# EAGLE schematic BMS Segment (EAGLE 7.7.0)
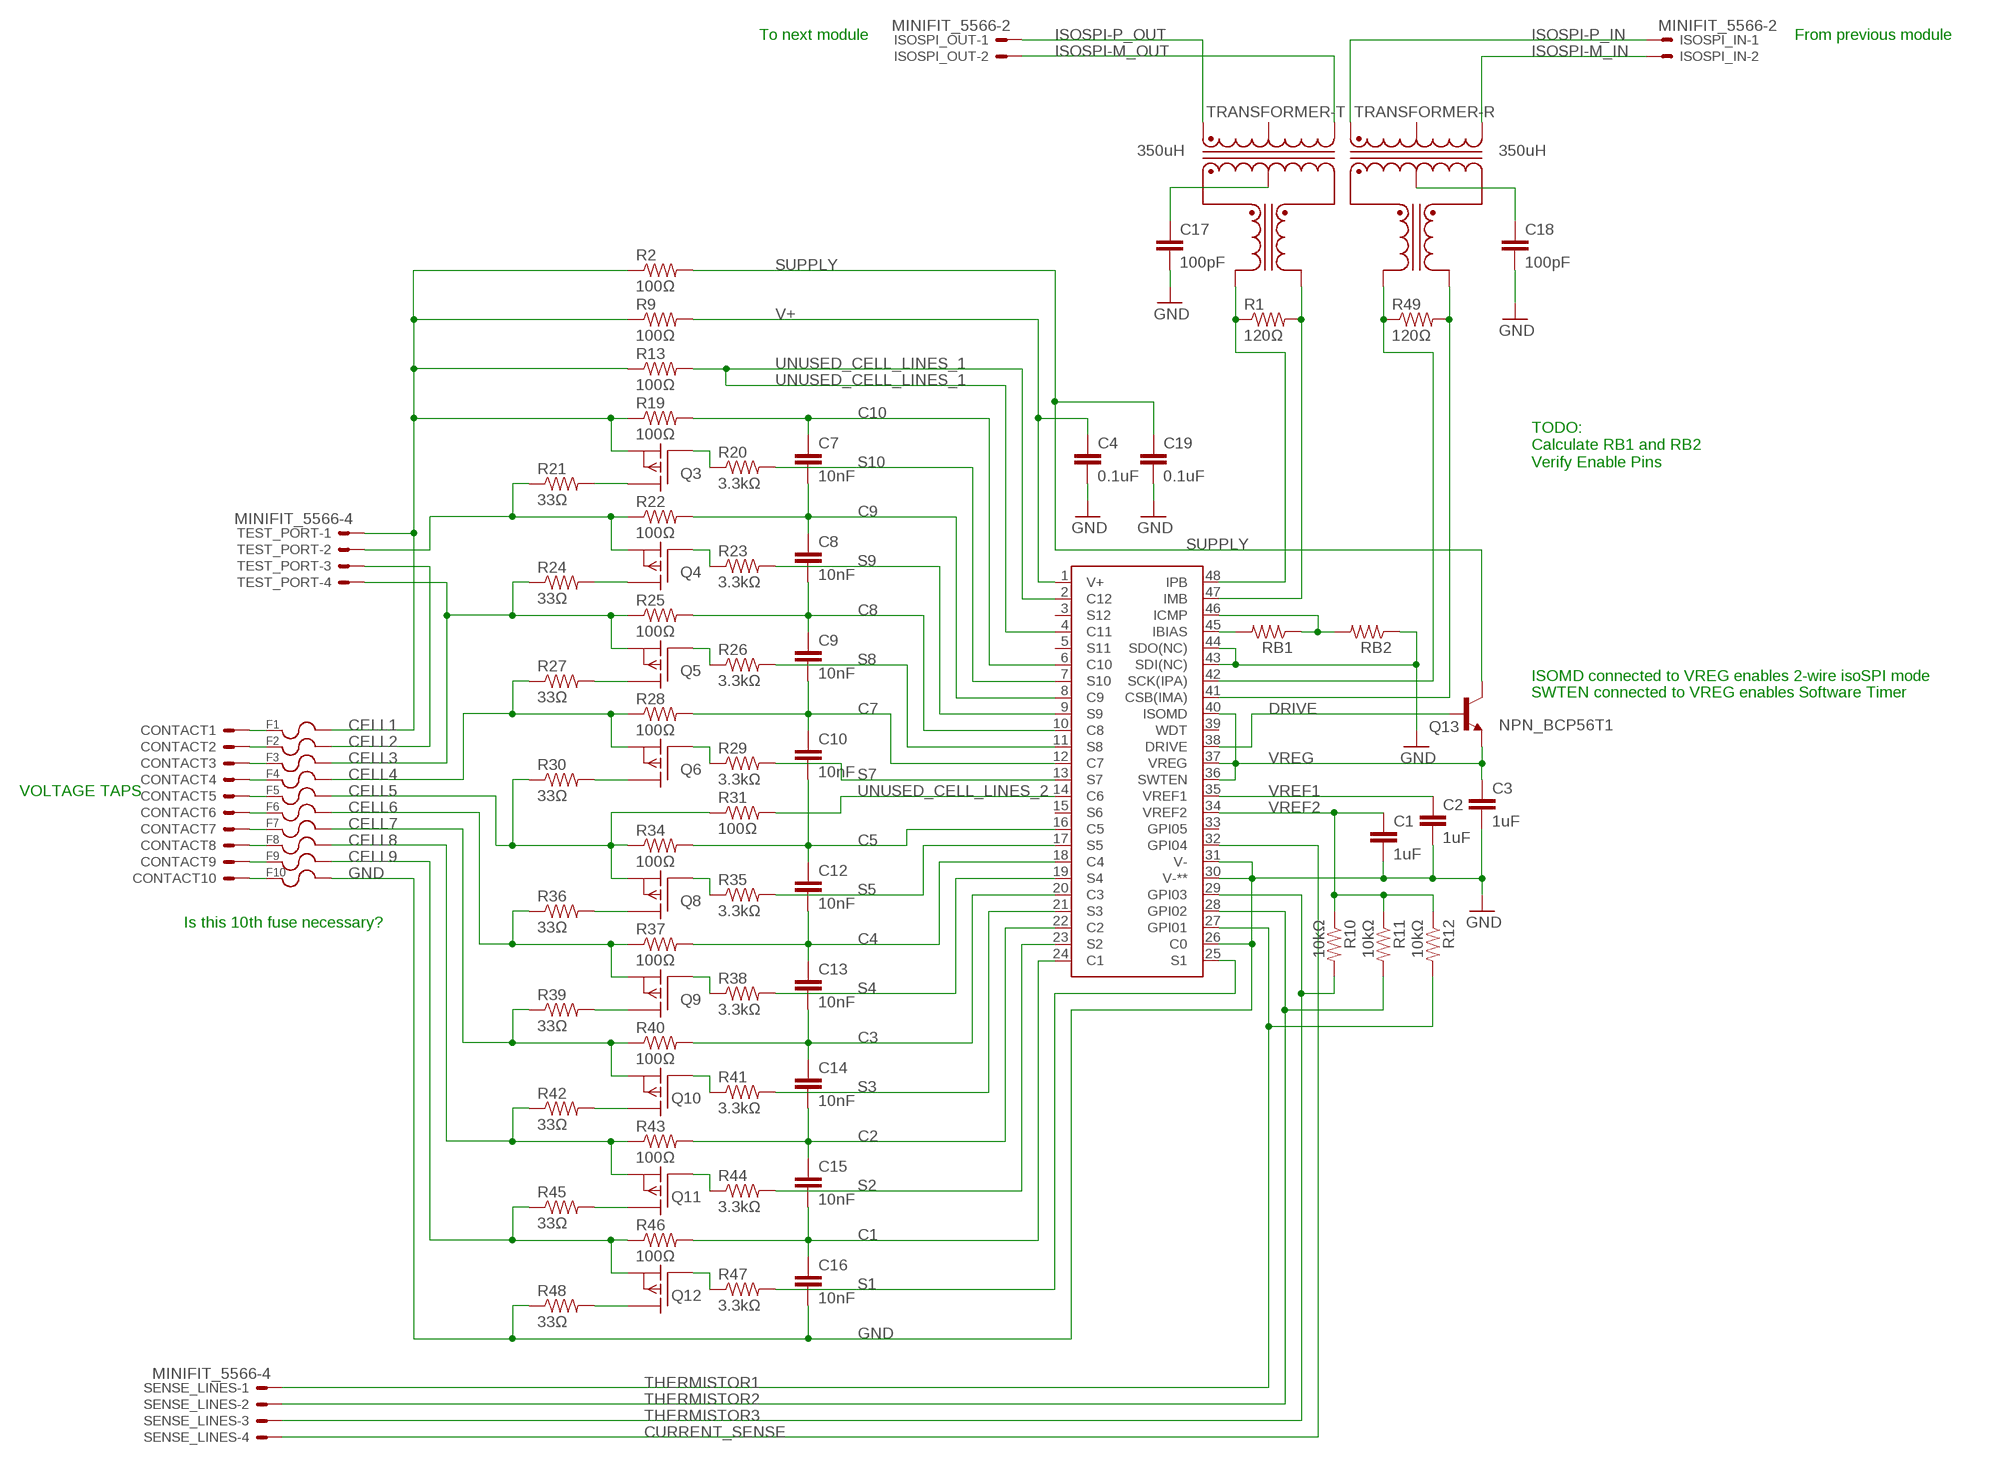
[diagram p0: schematic, sheet 1]

## Parts
C1  1uF  CAP0805  [0805]
C2  1uF  CAP0805  [0805]
C3  1uF  CAP0805  [0805]
C4  0.1uF  CAP0805  [0805]
C7  10nF  CAP0805  [0805]
C8  10nF  CAP0805  [0805]
C9  10nF  CAP0805  [0805]
C10  10nF  CAP0805  [0805]
C12  10nF  CAP0805  [0805]
C13  10nF  CAP0805  [0805]
C14  10nF  CAP0805  [0805]
C15  10nF  CAP0805  [0805]
C16  10nF  CAP0805  [0805]
C17  100pF  CAP0805  [0805]
C18  100pF  CAP0805  [0805]
C19  0.1uF  CAP0805  [0805]
CONTACT1  SPRING_CONTACT  [S1791-42R]
CONTACT2  SPRING_CONTACT  [S1791-42R]
CONTACT3  SPRING_CONTACT  [S1791-42R]
CONTACT4  SPRING_CONTACT  [S1791-42R]
CONTACT5  SPRING_CONTACT  [S1791-42R]
CONTACT6  SPRING_CONTACT  [S1791-42R]
CONTACT7  SPRING_CONTACT  [S1791-42R]
CONTACT8  SPRING_CONTACT  [S1791-42R]
CONTACT9  SPRING_CONTACT  [S1791-42R]
CONTACT10  SPRING_CONTACT  [S1791-42R]
F1  0751.0110_FUSE_CLIP  [0751.0110]
F2  0751.0110_FUSE_CLIP  [0751.0110]
F3  0751.0110_FUSE_CLIP  [0751.0110]
F4  0751.0110_FUSE_CLIP  [0751.0110]
F5  0751.0110_FUSE_CLIP  [0751.0110]
F6  0751.0110_FUSE_CLIP  [0751.0110]
F7  0751.0110_FUSE_CLIP  [0751.0110]
F8  0751.0110_FUSE_CLIP  [0751.0110]
F9  0751.0110_FUSE_CLIP  [0751.0110]
F10  0751.0110_FUSE_CLIP  [0751.0110]
ISOSPI_IN  MINIFIT_5566-2  [MINIFIT_5566-2]
ISOSPI_OUT  MINIFIT_5566-2  [MINIFIT_5566-2]
Q3  P-CHANNEL_MOSFET_DMP3099L-7  [SOT23]
Q4  P-CHANNEL_MOSFET_DMP3099L-7  [SOT23]
Q5  P-CHANNEL_MOSFET_DMP3099L-7  [SOT23]
Q6  P-CHANNEL_MOSFET_DMP3099L-7  [SOT23]
Q8  P-CHANNEL_MOSFET_DMP3099L-7  [SOT23]
Q9  P-CHANNEL_MOSFET_DMP3099L-7  [SOT23]
Q10  P-CHANNEL_MOSFET_DMP3099L-7  [SOT23]
Q11  P-CHANNEL_MOSFET_DMP3099L-7  [SOT23]
Q12  P-CHANNEL_MOSFET_DMP3099L-7  [SOT23]
Q13  NPN_BCP56T1  [SOT223]
R1  120Ω  RESISTOR0805-RES  [0805]
R2  100Ω  RESISTOR0805-RES  [0805]
R9  100Ω  RESISTOR0805-RES  [0805]
R10  10kΩ  RESISTOR0805-RES  [0805]
R11  10kΩ  RESISTOR0805-RES  [0805]
R12  10kΩ  RESISTOR0805-RES  [0805]
R13  100Ω  RESISTOR0805-RES  [0805]
R19  100Ω  RESISTOR0805-RES  [0805]
R20  3.3kΩ  RESISTOR0805-RES  [0805]
R21  33Ω  RESISTOR2512  [R2512]
R22  100Ω  RESISTOR0805-RES  [0805]
R23  3.3kΩ  RESISTOR0805-RES  [0805]
R24  33Ω  RESISTOR2512  [R2512]
R25  100Ω  RESISTOR0805-RES  [0805]
R26  3.3kΩ  RESISTOR0805-RES  [0805]
R27  33Ω  RESISTOR2512  [R2512]
R28  100Ω  RESISTOR0805-RES  [0805]
R29  3.3kΩ  RESISTOR0805-RES  [0805]
R30  33Ω  RESISTOR2512  [R2512]
R31  100Ω  RESISTOR0805-RES  [0805]
R34  100Ω  RESISTOR0805-RES  [0805]
R35  3.3kΩ  RESISTOR0805-RES  [0805]
R36  33Ω  RESISTOR2512  [R2512]
R37  100Ω  RESISTOR0805-RES  [0805]
R38  3.3kΩ  RESISTOR0805-RES  [0805]
R39  33Ω  RESISTOR2512  [R2512]
R40  100Ω  RESISTOR0805-RES  [0805]
R41  3.3kΩ  RESISTOR0805-RES  [0805]
R42  33Ω  RESISTOR2512  [R2512]
R43  100Ω  RESISTOR0805-RES  [0805]
R44  3.3kΩ  RESISTOR0805-RES  [0805]
R45  33Ω  RESISTOR2512  [R2512]
R46  100Ω  RESISTOR0805-RES  [0805]
R47  3.3kΩ  RESISTOR0805-RES  [0805]
R48  33Ω  RESISTOR2512  [R2512]
R49  120Ω  RESISTOR0805-RES  [0805]
RB1  RESISTOR0805-RES  [0805]
RB2  RESISTOR0805-RES  [0805]
SENSE_LINES  MINIFIT_5566-4  [MINIFIT_5566-4]
TEST_PORT  MINIFIT_5566-4  [MINIFIT_5566-4]
TRANSFORMER-  350uH  TRANSFORMER_749010013  [749010013]
U$2  LTC6804-1  [LTC6804]

## Nets
C1: C15.2 C16.1 R46.2 U$2.24(C1)
C2: C14.2 C15.1 R43.2 U$2.22(C2)
C3: C13.2 C14.1 R40.2 U$2.20(C3)
C4: C12.2 C13.1 R37.2 U$2.18(C4)
C5: C10.2 C12.1 R34.2 U$2.16(C5)
C7: C9.2 C10.1 R28.2 U$2.12(C7)
C8: C8.2 C9.1 R25.2 U$2.10(C8)
C9: C7.2 C8.1 R22.2 U$2.8(C9)
C10: C7.1 R19.2 U$2.6(C10)
CELL1: F1.R1 F1.R2 Q3.2(S) R2.1 R9.1 R13.1 R19.1 TEST_PORT.1
CELL2: F2.R1 F2.R2 Q4.2(S) R21.1 R22.1 TEST_PORT.2 TEST_PORT.3
CELL3: F3.R1 F3.R2 Q5.2(S) R24.1 R25.1 TEST_PORT.4
CELL4: F4.R1 F4.R2 Q6.2(S) R27.1 R28.1
CELL5: F5.R1 F5.R2 Q8.2(S) R30.1 R31.1 R34.1
CELL6: F6.R1 F6.R2 Q9.2(S) R36.1 R37.1
CELL7: F7.R1 F7.R2 Q10.2(S) R39.1 R40.1
CELL8: F8.R1 F8.R2 Q11.2(S) R42.1 R43.1
CELL9: F9.R1 F9.R2 Q12.2(S) R45.1 R46.1
CURRENT_SENSE: SENSE_LINES.4 U$2.32(GPI04)
DRIVE: Q13.1(BASE) U$2.38(DRIVE)
GND: C1.2 C2.2 C3.2 C4.2 C16.2 C17.2 C18.2 C19.2 F10.R1 F10.R2 R48.1 RB2.1 U$2.26(C0) U$2.30(V-**) U$2.31(V-) U$2.43(SDI(NC)) U$2.44(SDO(NC))
ISOSPI-M_IN: ISOSPI_IN.2 TRANSFORMER-.8(R:D-)
ISOSPI-M_OUT: ISOSPI_OUT.2 TRANSFORMER-.3(T:D-)
ISOSPI-P_IN: ISOSPI_IN.1 TRANSFORMER-.6(R:D+)
ISOSPI-P_OUT: ISOSPI_OUT.1 TRANSFORMER-.1(T:D+)
N$1: C18.1 TRANSFORMER-.10(R:CX)
N$2: C17.1 TRANSFORMER-.15(T:CX)
N$4: RB1.2 U$2.45(IBIAS)
N$5: R1.1 TRANSFORMER-.16(T:X+) U$2.48(IPB)
N$7: RB1.1 RB2.2 U$2.46(ICMP)
N$8: R49.1 TRANSFORMER-.11(R:X+) U$2.42(SCK(IPA))
N$9: R49.2 TRANSFORMER-.9(R:X-) U$2.41(CSB(IMA))
N$14: CONTACT1.P$1(S) F1.L1 F1.L2
N$15: Q3.1(G) R20.1
N$16: CONTACT2.P$1(S) F2.L1 F2.L2
N$17: CONTACT3.P$1(S) F3.L1 F3.L2
N$18: Q3.3(D) R21.2
N$19: CONTACT4.P$1(S) F4.L1 F4.L2
N$20: Q8.1(G) R35.1
N$22: Q9.1(G) R38.1
N$23: CONTACT5.P$1(S) F5.L1 F5.L2
N$24: CONTACT6.P$1(S) F6.L1 F6.L2
N$25: Q4.3(D) R24.2
N$26: CONTACT7.P$1(S) F7.L1 F7.L2
N$27: Q10.1(G) R41.1
N$28: Q11.1(G) R44.1
N$29: Q12.1(G) R47.1
N$30: Q5.3(D) R27.2
N$31: CONTACT8.P$1(S) F8.L1 F8.L2
N$32: CONTACT9.P$1(S) F9.L1 F9.L2
N$33: CONTACT10.P$1(S) F10.L1 F10.L2
N$36: Q6.3(D) R30.2
N$42: R1.2 TRANSFORMER-.14(T:X-) U$2.47(IMB)
N$43: Q8.3(D) R36.2
N$51: Q9.3(D) R39.2
N$53: Q10.3(D) R42.2
N$61: Q11.3(D) R45.2
N$66: Q12.3(D) R48.2
N$68: Q4.1(G) R23.1
N$69: Q5.1(G) R26.1
N$70: Q6.1(G) R29.1
S1: R47.2 U$2.25(S1)
S2: R44.2 U$2.23(S2)
S3: R41.2 U$2.21(S3)
S4: R38.2 U$2.19(S4)
S5: R35.2 U$2.17(S5)
S7: R29.2 U$2.13(S7)
S8: R26.2 U$2.11(S8)
S9: R23.2 U$2.9(S9)
S10: R20.2 U$2.7(S10)
SUPPLY: C19.1 Q13.2(COLLECTOR) Q13.4(COLLECTOR) R2.2
THERMISTOR1: R12.2 SENSE_LINES.1 U$2.27(GPI01)
THERMISTOR2: R11.2 SENSE_LINES.2 U$2.28(GPI02)
THERMISTOR3: R10.2 SENSE_LINES.3 U$2.29(GPI03)
UNUSED_CELL_LINES_1: R13.2 U$2.2(C12) U$2.4(C11)
UNUSED_CELL_LINES_2: R31.2 U$2.14(C6)
V+: C4.1 R9.2 U$2.1(V+)
VREF1: C2.1 U$2.35(VREF1)
VREF2: C1.1 R10.1 R11.1 R12.1 U$2.34(VREF2)
VREG: C3.1 Q13.3(EMITTER) U$2.36(SWTEN) U$2.37(VREG) U$2.40(ISOMD)
Unconnected: TRANSFORMER-.2(T:CD) TRANSFORMER-.7(R:CD) U$2.3(S12) U$2.5(S11) U$2.15(S6) U$2.33(GPI05) U$2.39(WDT)

## Notes on the sheet
- To next module | From previous module
- TODO:
  Calculate RB1 and RB2
  Verify Enable Pins
- ISOMD connected to VREG enables 2-wire isoSPI mode
- SWTEN connected to VREG enables Software Timer
- VOLTAGE TAPS
- Is this 10th fuse necessary?

## Library data of the parts
C1-C4 C7-C10 C12-C19 = HyTechDevices:CAP: Capacitor Standard 0603 ceramic capacitor, and 0.1" leaded capacitor.
CONTACT1-CONTACT10 = HyTechDevices:SPRING_CONTACT: Harwin Surface Mount Spring Contact Datasheet <http://www.mouser.com/ds/2/181/S1791-42R-351038.pdf>
F1-F10 = HyTechDevices:0751.0110_FUSE_CLIP: Schurter 0751.0110 Brass Fuse Clip Datasheet <http://www.mouser.com/ds/2/358/typ_OG__Clip__5x20-2553.pdf>
ISOSPI_IN ISOSPI_OUT = HyTechDevices:MINIFIT_5566-2: Mini-Fit Junior connector 2 pole Source: http://www.molex.com; OC_FARNELL: 1822072; OC_NEWARK: unknown
Q3-Q6 Q8-Q12 = HyTechDevices:P-CHANNEL_MOSFET_DMP3099L-7: Diodes Incorporated P-Channel Enhancement Mode MOSFET Datasheet <http://www.mouser.com/ds/2/115/DMP3099L-266220.pdf>
Q13 = HyTechDevices:NPN_BCP56T1: ON Semiconductor BCP56 Series NPN Silicon Epitaxial Transistor Datasheet <http://www.mouser.com/ds/2/308/BCP56T1-D-104805.pdf>
R1 R2 R9-R13 R19-R31 R34-R49 RB1 RB2 = HyTechDevices:RESISTOR: Resistor Basic schematic elements and footprints for 0603, 1206, and PTH resistors.
SENSE_LINES TEST_PORT = HyTechDevices:MINIFIT_5566-4: Mini-Fit Junior connector 4 pole Source: http://www.molex.com; OC_FARNELL: unknown; OC_NEWARK: unknown
TRANSFORMER- = HyTechDevices:TRANSFORMER_749010013: Wurth Electronics Midcom 749010013 10/100BaseTX Ethernet Transformer Datasheet <http://www.mouser.com/ds/2/445/749010013-311000.pdf> Mouser Page <http://www.mouser.com/ProductDetail/Wurth-Electronics-Midcom/749010013/?qs=40TFAHZMFvcjCZphxWYgVw%3D%3D>
U$2 = HyTechDevices:LTC6804-1: Linear Technology LTC6804-1 Multicell Battery Monitor Datasheet <http://cds.linear.com/docs/en/datasheet/680412fc.pdf>